# EAGLE schematic board (EAGLE 9.6.0)
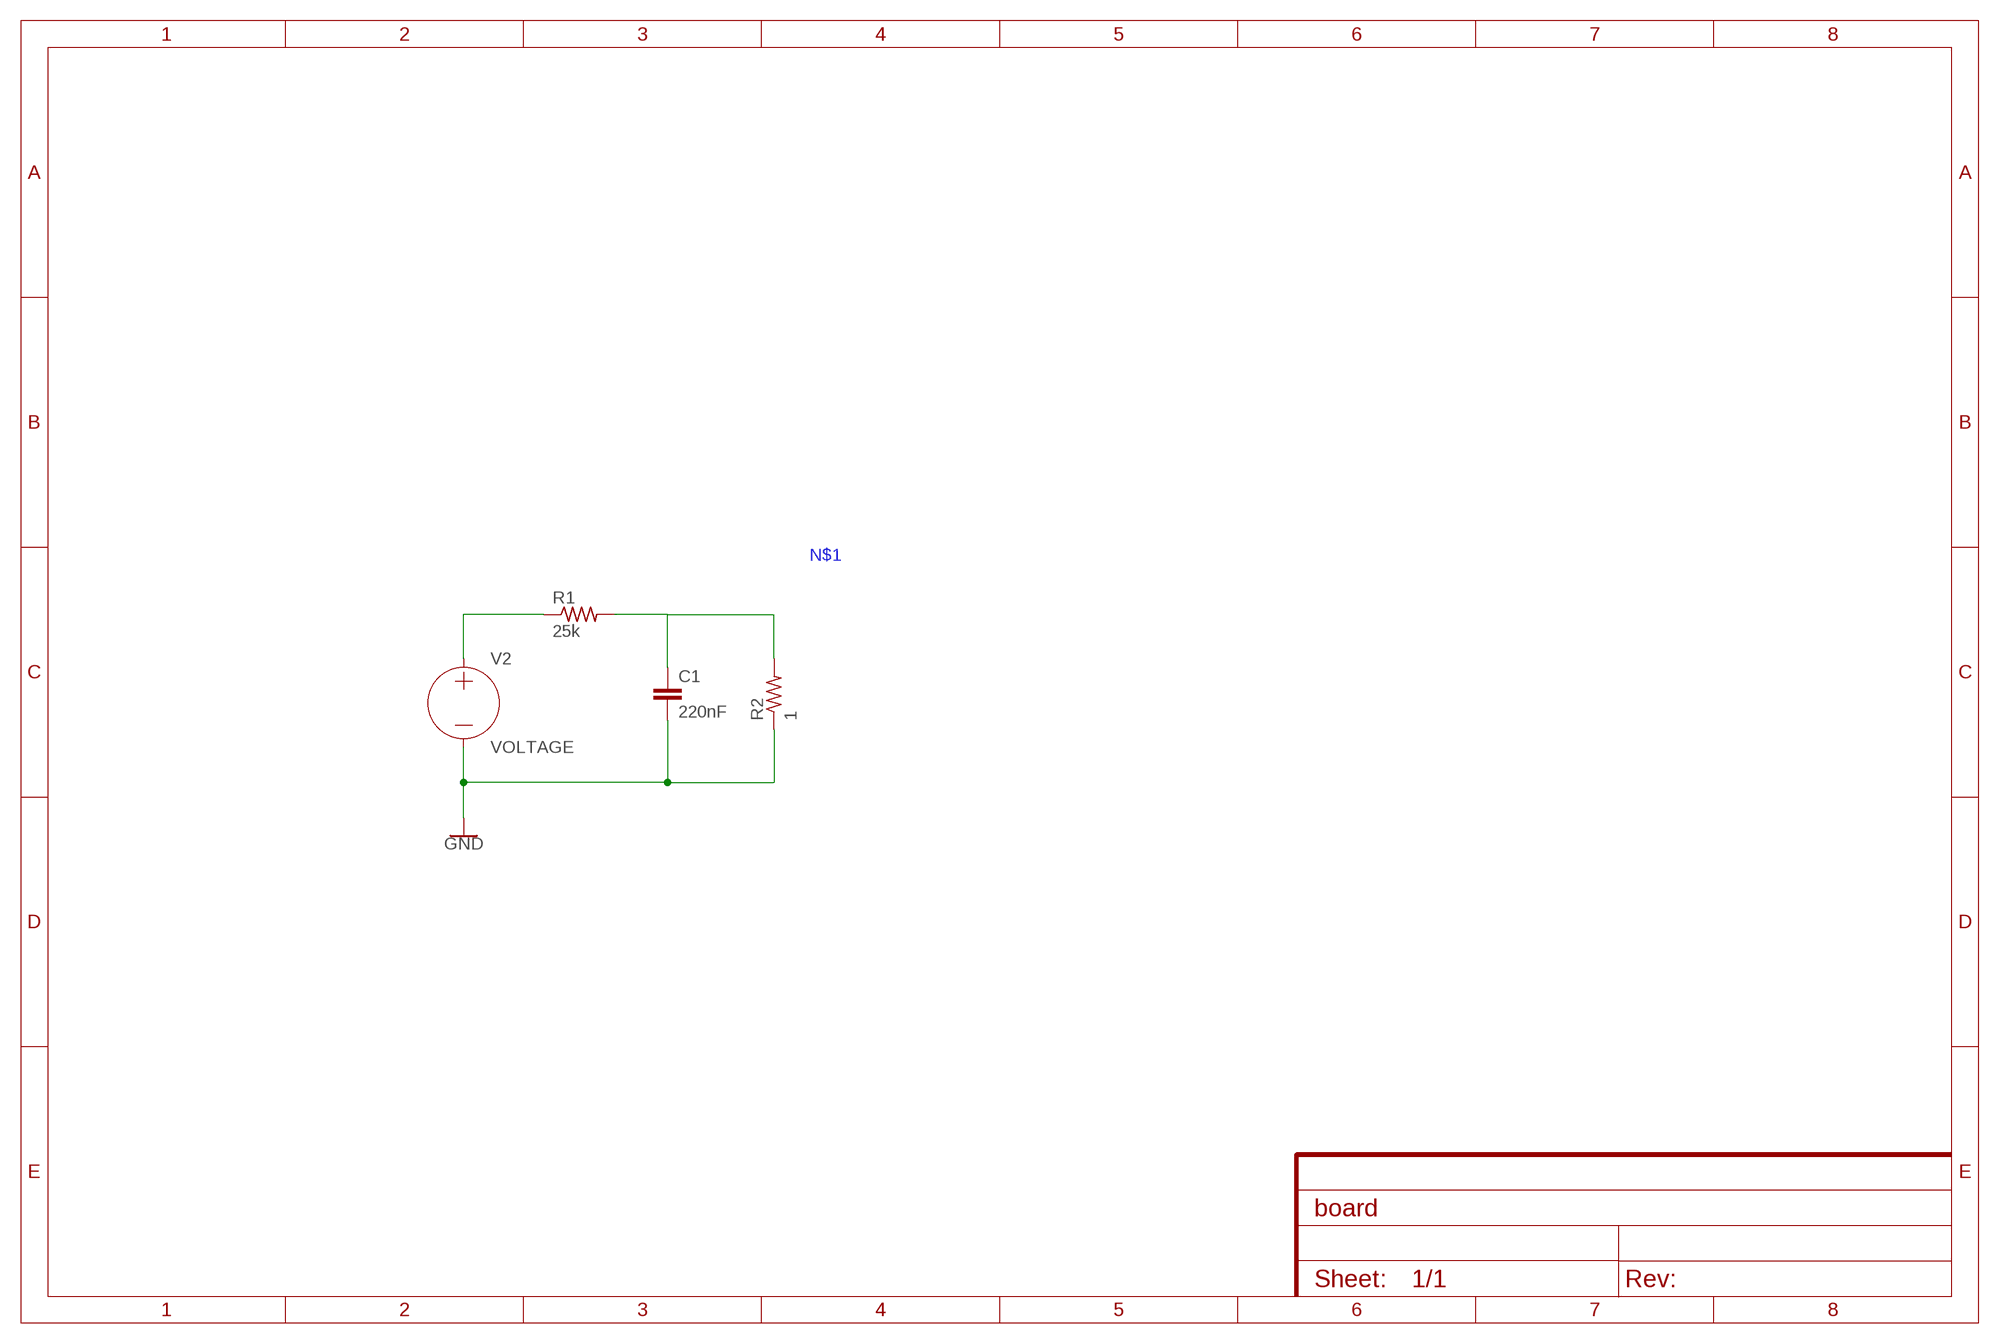
[diagram p0: schematic, sheet 1]

## Parts
C1  220nF  C-EUC0603  [C0603]
R1  25k  R-US_R0603  [R0603]
R2  1  R-US_R0603  [R0603]
V2  VOLTAGE  (no package)

## Nets
GND: C1.2 R2.1 V2.-
N$1: C1.1 R1.2 R2.2
N$3: R1.1 V2.+

## Library data of the parts
C1 = rcl:C-EU: CAPACITOR, European symbol; SPICEPREFIX: C
R1 R2 = rcl:R-US_: RESISTOR, American symbol; SPICEPREFIX: R
V2 = lt-spice-simulation:VOLTAGE: Voltage Source, either DC, AC, PULSE, SINE, PWL, EXP, or SFFM; SPICEPREFIX: V